# Altium project Project_01.PrjPcb
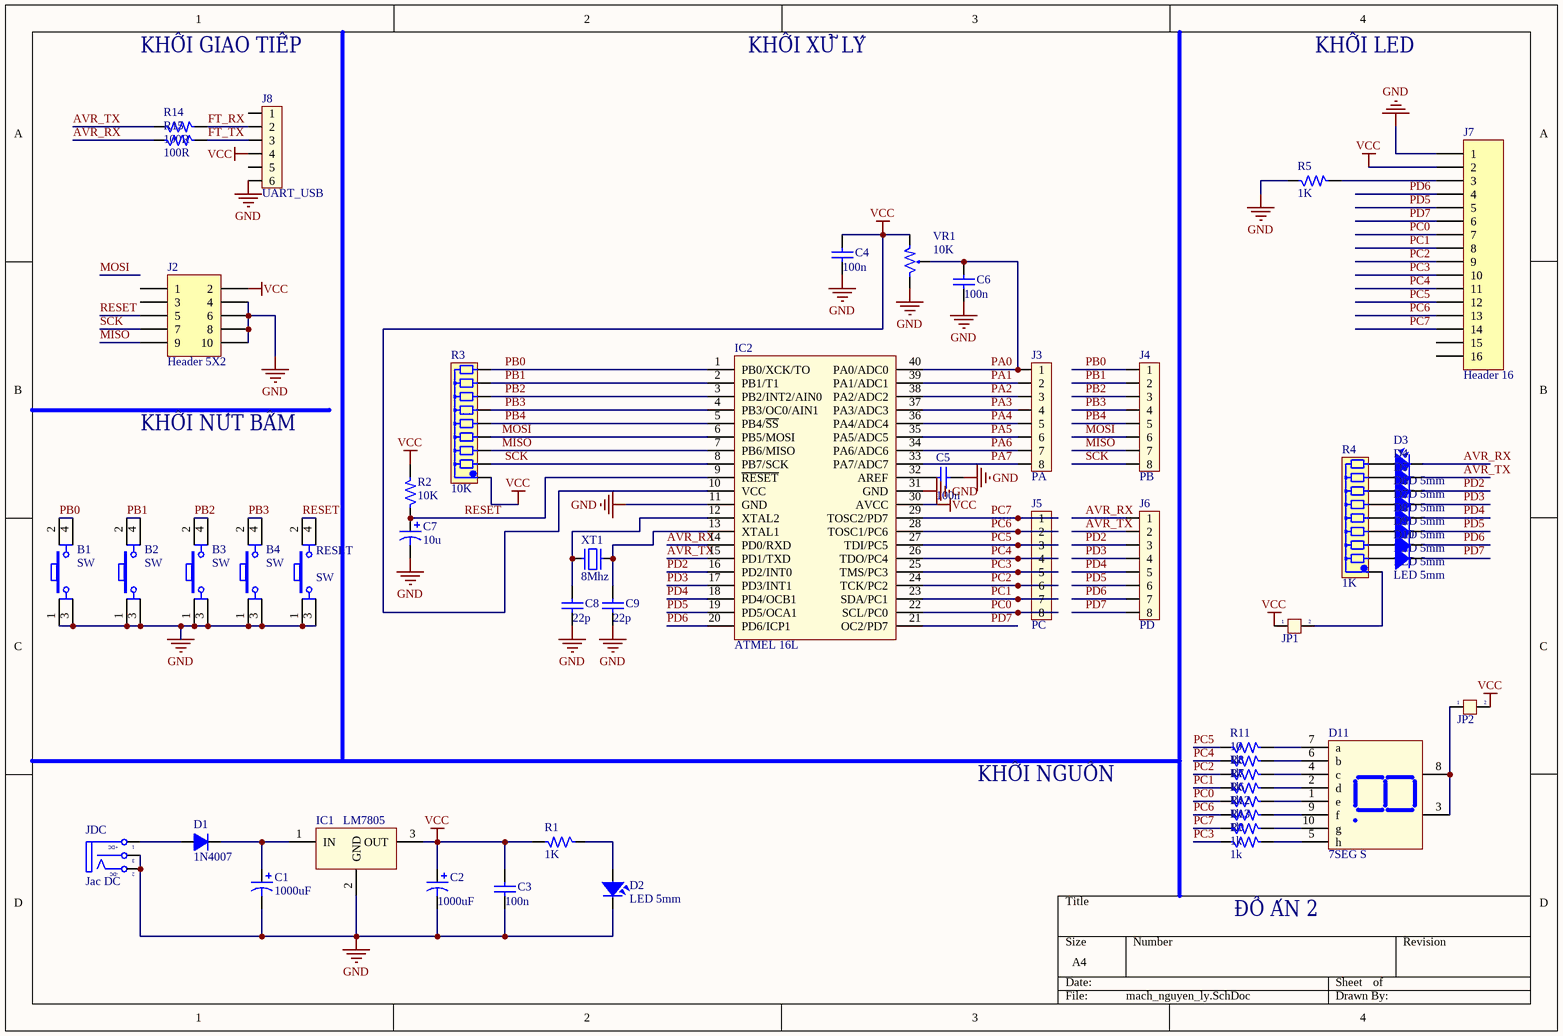
[diagram p0: mach_nguyen_ly.SchDoc]
1 sheet, 54 parts. Net scope: global (net labels, ports and power ports of the same name join across sheets).
Board file: PCB1.PcbDoc

## Sheet mach_nguyen_ly.SchDoc
size A4; SheetNumber: 1; SheetTotal: 1

### Parts
10  1k  [R1/6W]
B1  SW  [SW4]
B2  SW  [SW4]
B3  SW  [SW4]
B4  SW  [SW4]
C1  1000uF  [C10mm]
C2  1000uF  [C10mm]
C3  value 100n  [Tu-ceramic]  (hidden comment: Capacitor Ceramic)
C4  value 100n  [Tu-ceramic]  (hidden comment: Capacitor Ceramic)
C5  value 100n  [Tu-ceramic]  (hidden comment: Capacitor Ceramic)
C6  value 100n  [Tu-ceramic]  (hidden comment: Capacitor Ceramic)
C7  10u  [C5mm]
C8  value 22p  [Tu-ceramic]  (hidden comment: Capacitor Ceramic)
C9  value 22p  [Tu-ceramic]  (hidden comment: Capacitor Ceramic)
D1  1N4007  [D1A]
D2  LED 5mm  [LED-3]
D3  LED 5mm  [LED-3]
D4  LED 5mm  [LED-3]
D5  LED 5mm  [LED-3]
D6  LED 5mm  [LED-3]
D7  LED 5mm  [LED-3]
D8  LED 5mm  [LED-3]
D9  LED 5mm  [LED-3]
D10  LED 5mm  [LED-3]
D11  7SEG S  [7SEGS]
IC1  LM7805  [QTO-220]
IC2  ATMEL 16L  [DIP40/W0.6]
J2  Header 5X2  [HDR2X5]
J3  PA  [JP8]
J4  PB  [JP8]
J5  PC  [JP8]
J6  PD  [JP8]
J7  Header 16  [HDR1X16]
J8  UART_USB  [JP6]
JDC  Jac DC  [DC-IN]
JP1  Jumper 2  [JP2]  (value not drawn)
JP2  Jumper 2  [JP2]  (value not drawn)
R1  1K  [R1/6W]
R2  10K  [R1/6W]
R3  10K  [RN8]
R4  1K  [RN8]
R5  1K  [R1/6W]
R6  1k  [R1/6W]
R7  1k  [R1/6W]
R8  1k  [R1/6W]
R9  1k  [R1/6W]
R11  1k  [R1/6W]
R12  1k  [R1/6W]
R13  1k  [R1/6W]
R14  100R  [R1/6W]
R15  100R  [R1/6W]
RESET  SW  [SW4]
VR1  10K  [VR]
XT1  8Mhz  [XT2]

### Nets
GND: B1.1 B1.3 B2.1 B2.3 B3.1 B3.3 B4.1 B4.3 C1.2 C2.2 C3.1 C4.1 C5.1 C6.1 C7.2 C8.1 C9.1 D2.2 IC1.2(GND) IC2.11(GND) IC2.31(GND) J2.4 J2.6 J2.8 J2.10 J7.1 J8.6 JDC.2(TN) JDC.3(S) R5.1 RESET.1 RESET.3 VR1.3
VCC: C2.1 C3.2 C4.2 IC1.3(OUT) IC2.10(VCC) IC2.30(AVCC) J2.2 J7.2 J8.4 JP1.1 JP2.2 R1.2 R2.2 R3.1 VR1.1
AVR_RX: D3.2 IC2.14(PD0/RXD) J6.1 R15.1
AVR_TX: D4.2 IC2.15(PD1/TXD) J6.2 R14.1
FT_RX: J8.2 R14.2
FT_TX: J8.3 R15.2
MISO: IC2.7(PB6/MISO) J2.9 J4.7 R3.3
MOSI: IC2.6(PB5/MOSI) J4.6 R3.4
PA0: C6.2 IC2.40(PA0/ADC0) J3.1 VR1.2
PA1: IC2.39(PA1/ADC1) J3.2
PA2: IC2.38(PA2/ADC2) J3.3
PA3: IC2.37(PA3/ADC3) J3.4
PA4: IC2.36(PA4/ADC4) J3.5
PA5: IC2.35(PA5/ADC5) J3.6
PA6: IC2.34(PA6/ADC6) J3.7
PA7: IC2.33(PA7/ADC7) J3.8
PB0: B1.2 B1.4 IC2.1(PB0/XCK/TO) J4.1 R3.9
PB1: B2.2 B2.4 IC2.2(PB1/T1) J4.2 R3.8
PB2: B3.2 B3.4 IC2.3(PB2/INT2/AIN0) J4.3 R3.7
PB3: B4.2 B4.4 IC2.4(PB3/OC0/AIN1) J4.4 R3.6
PB4: IC2.5(PB4/~{SS}) J4.5 R3.5
PC0: IC2.22(SCL/PC0) J5.8 J7.7 R6.1
PC1: IC2.23(SDA/PC1) J5.7 J7.8 R7.1
PC2: IC2.24(TCK/PC2) J5.6 J7.9 R8.1
PC3: IC2.25(TMS/PC3) J5.5 J7.10 R9.1
PC4: 10.1 IC2.26(TDO/PC4) J5.4 J7.11
PC5: IC2.27(TDI/PC5) J5.3 J7.12 R11.1
PC6: IC2.28(TOSC1/PC6) J5.2 J7.13 R12.1
PC7: IC2.29(TOSC2/PD7) J5.1 J7.14 R13.1
PD2: D5.2 IC2.16(PD2/INT0) J6.3
PD3: D6.2 IC2.17(PD3/INT1) J6.4
PD4: D7.2 IC2.18(PD4/OCB1) J6.5
PD5: D8.2 IC2.19(PD5/OCA1) J6.6 J7.5
PD6: D9.2 IC2.20(PD6/ICP1) J6.7 J7.4
PD7: D10.2 IC2.21(OC2/PD7) J6.8 J7.6
RESET: C7.1 IC2.9(~{RESET}) J2.5 R2.1 RESET.2 RESET.4
SCK: IC2.8(PB7/SCK) J2.7 J4.8 R3.2
Net10_2: 10.2 D11.6(b)
NetC1_1: C1.1 D1.2(K) IC1.1(IN)
NetC5_2: C5.2 IC2.32(AREF)
NetC8_2: C8.2 IC2.12(XTAL2) XT1.1
NetC9_2: C9.2 IC2.13(XTAL1) XT1.2
NetD1_1: D1.1(A) JDC.1(T)
NetD2_1: D2.1 R1.1
NetD3_1: D3.1 R4.9
NetD4_1: D4.1 R4.8
NetD5_1: D5.1 R4.7
NetD6_1: D6.1 R4.6
NetD7_1: D7.1 R4.5
NetD8_1: D8.1 R4.4
NetD9_1: D9.1 R4.3
NetD10_1: D10.1 R4.2
NetD11_1: D11.1(e) R6.2
NetD11_2: D11.2(d) R7.2
NetD11_3: D11.3(Vcc) D11.8(Vcc) JP2.1
NetD11_4: D11.4(c) R8.2
NetD11_5: D11.5(h) R9.2
NetD11_7: D11.7(a) R11.2
NetD11_9: D11.9(f) R12.2
NetD11_10: D11.10(g) R13.2
NetJ7_3: J7.3 R5.2
NetJP1_2: JP1.2 R4.1

Not connected (* = marked no-connect by the designer): J2 1 3; J7 15 16; J8 1 5

### Notes on the sheet
- KHỐI GIAO TIẾP
- KHỐI XỬ LÝ
- KHỐI LED
- KHỐI NÚT BẤM
- KHỐI NGUỒN
- ĐỒ ÁN 2
- (in symbol DCIN) +DC; -DC

### Library data of the parts
10 R1 R2 R5-R9 R11-R15 = Res: Resistor 1/4W; Value: R1/4W - 1K
B1-B4 RESET = SW4: Switch button 4 pin; Value: Button chip 4 pin
C1 C2 = Cap Pol 12mm: Polarized Capacitor (Axial); Published: 8-Jun-2000; LatestRevisionDate: 17-Jul-2002; LatestRevisionNote: Re-released for DXP Platform.; PackageReference: POLAR0.8; Publisher: Altium Limited
C3-C6 C8 C9 = CapDecop: Capacitor; Published: 8-Jun-2000; LatestRevisionDate: 17-Jul-2002; LatestRevisionNote: Re-released for DXP Platform.; PackageReference: RAD-0.3; Publisher: Altium Limited
C7 = Cap Pol 5mm: Polarized Capacitor (Axial); Published: 8-Jun-2000; LatestRevisionDate: 17-Jul-2002; LatestRevisionNote: Re-released for DXP Platform.; PackageReference: POLAR0.8; Publisher: Altium Limited
D1 = D1A: Diode 1A; Value: 1N4007
D2-D10 = LED: LED Single colour Green and Red; Value: LED 3 ly Single Colour
D11 = LED7S: Single 7 Seg Dipslay; Value: LED 7S SEG
IC1 = LM78xx: On ap +, from + 5 to + 24VDC; Value: LM7805
IC2 = Atmega16L: 8-Bit AVR Microcontroller with 16K Bytes of In-System Programmable Flash Memory; Value: Atmega 16L
J2 = Header 5X2: Header, 5-Pin, Dual row; LatestRevisionDate: 17-Jul-2002; LatestRevisionNote: Re-released for DXP Platform.; Publisher: Altium Limited
J3-J6 = JP8: JP8 PIN; Value: JP7
J7 = Header 16: Header, 16-Pin; LatestRevisionDate: 17-Jul-2002; LatestRevisionNote: Re-released for DXP Platform.; Publisher: Altium Limited
J8 = JP6_1: JP6 PIN; Value: JP7
JDC = DCIN: Jac DC input; Value: Jac DC
JP1 JP2 = JP 2: Value: JP 2
R3 R4 = ResN8: Resistor 8 (Thanh); Value: Tro thanh 10K
VR1 = VR1: Var Resistor; Value: VR 10K
XT1 = XT2: Crystal For all Crystal 2pin.; Value: 4Mhz